# Altium schematic sheet CAN2UART.SchDoc
size A4
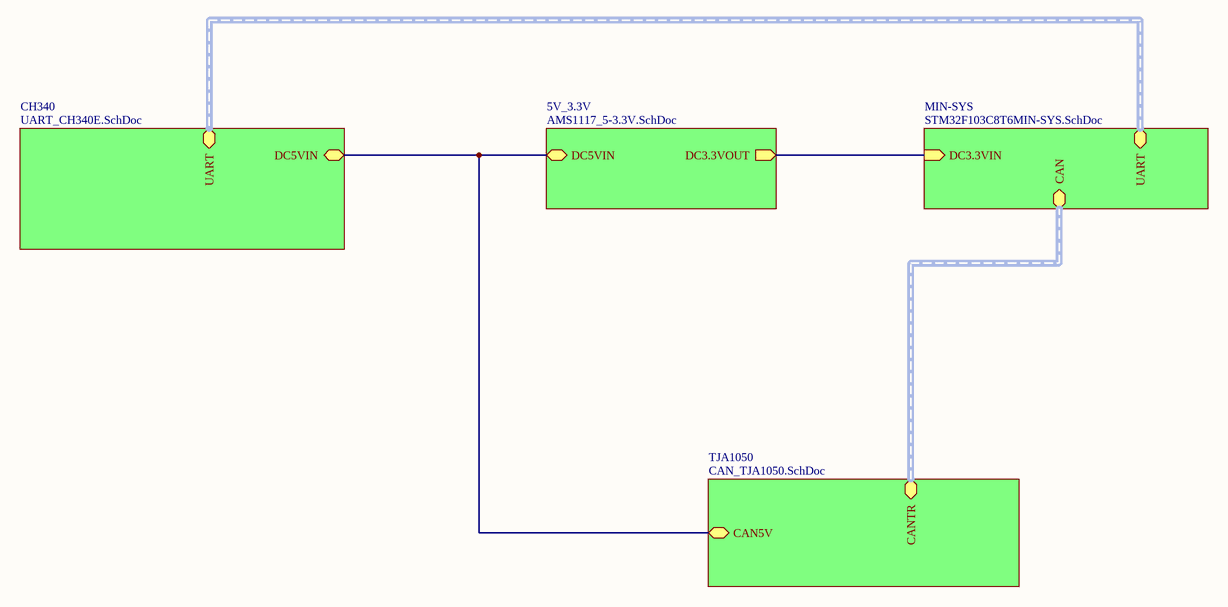
[diagram p0: CAN2UART.SchDoc]

## Sub-sheets
5V_3.3V = AMS1117_5-3.3V.SchDoc: DC5VIN, DC3.3VOUT (out)
CH340 = UART_CH340E.SchDoc: DC5VIN, UART (harness UART)
MIN-SYS = STM32F103C8T6MIN-SYS.SchDoc: DC3.3VIN (in), CAN (harness CAN), UART (harness UART)
TJA1050 = CAN_TJA1050.SchDoc: CANTR (harness CAN), CAN5V

## Nets
(unnamed): sheet 5V_3.3V/DC5VIN, sheet TJA1050/CAN5V, sheet CH340/DC5VIN
(unnamed): sheet 5V_3.3V/DC3.3VOUT, sheet MIN-SYS/DC3.3VIN

## Buses and harness runs
harness sheet CH340/UART = sheet MIN-SYS/UART
harness sheet MIN-SYS/CAN = sheet TJA1050/CANTR